# Altium schematic sheet SCH_vibration_array.schdoc
size 313 x 214 mm
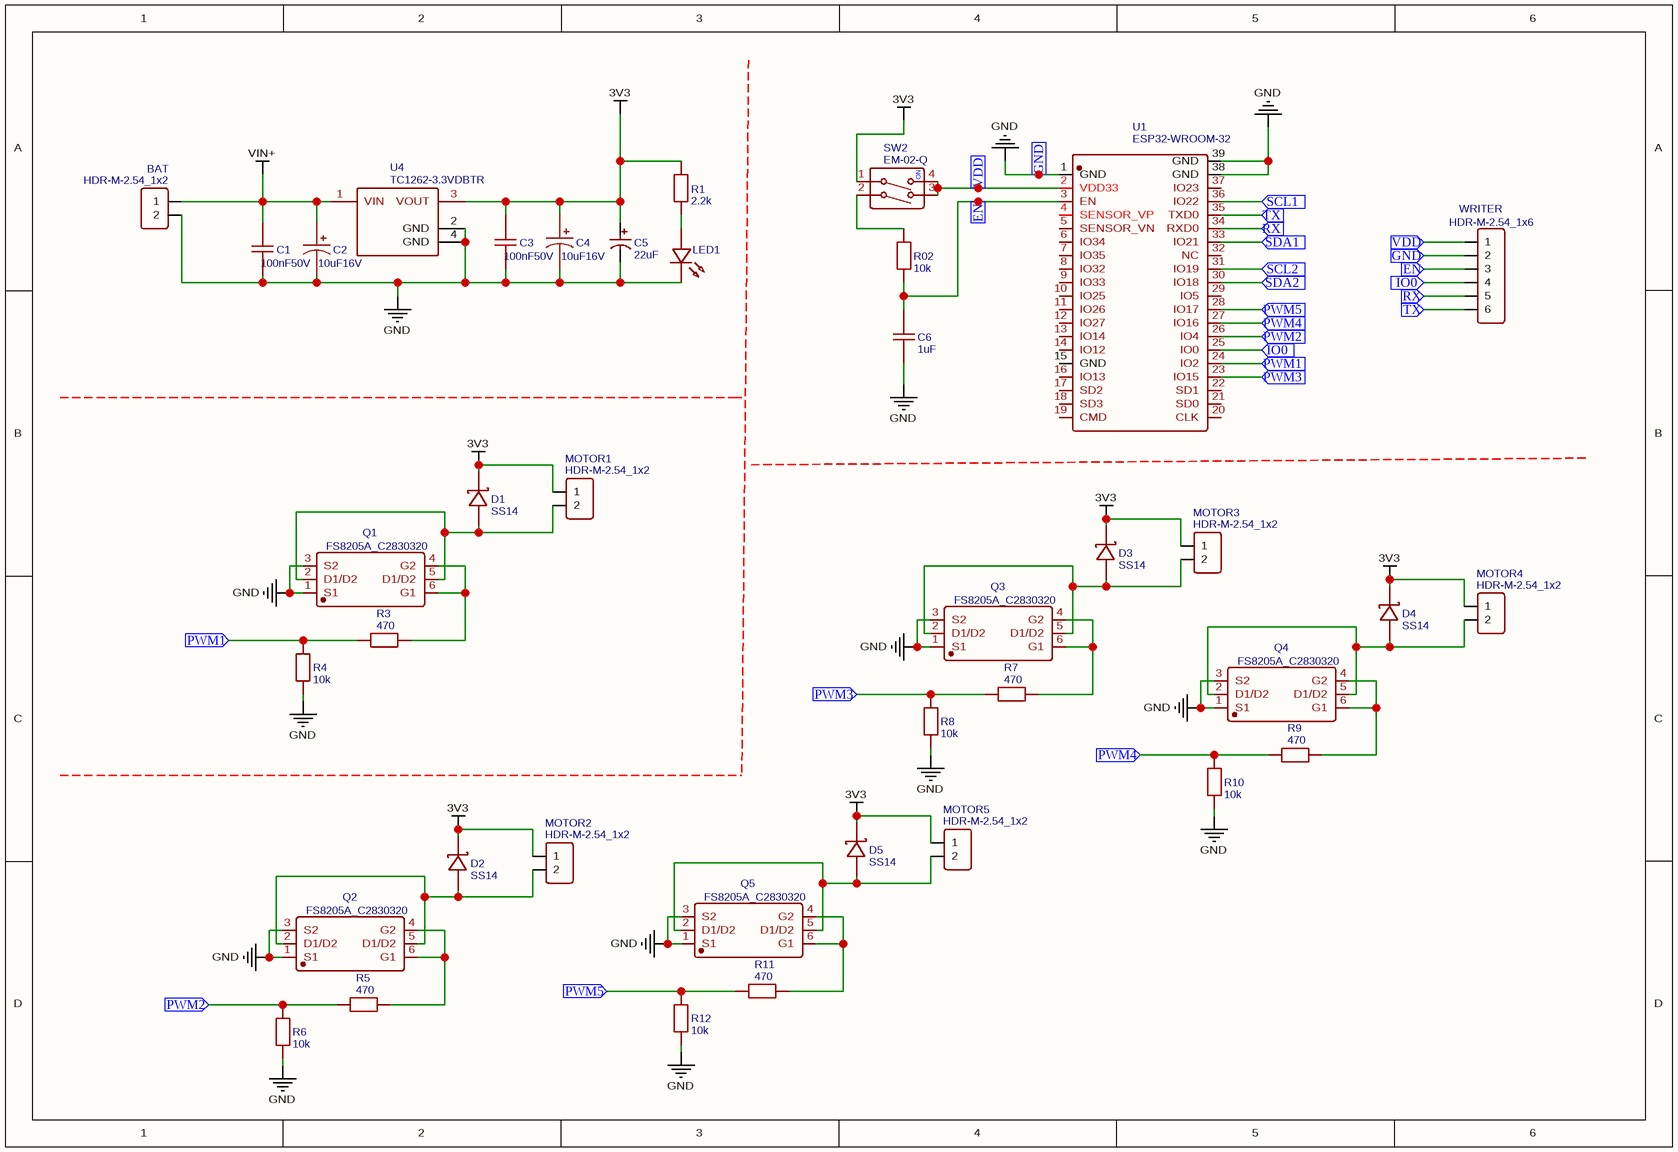
[diagram p0: SCH_vibration_array.schdoc]

## Parts
BAT  HDR-M-2.54_1x2  [HDR-M-2.54_1X2]
C1  100nF50V  [C0603]
C2  10uF16V  [C0805]
C3  100nF50V  [C0603]
C4  10uF16V  [C0805]
C5  22uF  [CAP-TH_BD5.0-P2.00-D0.8-FD]
C6  1uF  [C0603]
D1  SS14  [SMA_L4.4-W2.8-LS5.4-RD]
D2  SS14  [SMA_L4.4-W2.8-LS5.4-RD]
D3  SS14  [SMA_L4.4-W2.8-LS5.4-RD]
D4  SS14  [SMA_L4.4-W2.8-LS5.4-RD]
D5  SS14  [SMA_L4.4-W2.8-LS5.4-RD]
LED1  LED-0603_R  [LED0603_RED]  (value not drawn)
MOTOR1  HDR-M-2.54_1x2  [HDR-M-2.54_1X2]
MOTOR2  HDR-M-2.54_1x2  [HDR-M-2.54_1X2]
MOTOR3  HDR-M-2.54_1x2  [HDR-M-2.54_1X2]
MOTOR4  HDR-M-2.54_1x2  [HDR-M-2.54_1X2]
MOTOR5  HDR-M-2.54_1x2  [HDR-M-2.54_1X2]
Q1  FS8205A_C2830320  [SOT-23-6_L2.9-W1.6-P0.95-LS2.8-BR]
Q2  FS8205A_C2830320  [SOT-23-6_L2.9-W1.6-P0.95-LS2.8-BR]
Q3  FS8205A_C2830320  [SOT-23-6_L2.9-W1.6-P0.95-LS2.8-BR]
Q4  FS8205A_C2830320  [SOT-23-6_L2.9-W1.6-P0.95-LS2.8-BR]
Q5  FS8205A_C2830320  [SOT-23-6_L2.9-W1.6-P0.95-LS2.8-BR]
R1  2.2k  [R0603]
R02  10k  [R0603]
R3  470  [R0603]
R4  10k  [R0603]
R5  470  [R0603]
R6  10k  [R0603]
R7  470  [R0603]
R8  10k  [R0603]
R9  470  [R0603]
R10  10k  [R0603]
R11  470  [R0603]
R12  10k  [R0603]
SW2  EM-02-Q  [SW-SMD_4P-L5.0-W6.0-P2.54-LS9.8]
U1  ESP32-WROOM-32  [WIFIM-SMD_39P-L25.5-W18.0-P1.27]
U4  TC1262-3.3VDBTR  [SOT-223_L6.5-W3.5-P2.30-LS7.0-BR]
WRITER  HDR-M-2.54_1x6  [HDR-M-2.54_1X6]

## Ports
EN (in), GND (in), IO0 (in), PWM1 (in), PWM2 (in), PWM3 (in), PWM4 (in), PWM5 (in), RX (in), SCL1 (in), SCL2 (in), SDA1 (in), SDA2 (in), TX (in), VDD (in)

## Nets
3V3: C3.2 C4.1 C5.1 D1.1(K) D2.1(K) D3.1(K) D4.1(K) D5.1(K) MOTOR1.1 MOTOR2.1 MOTOR3.1 MOTOR4.1 MOTOR5.1 R1.2 SW2.1 U4.3(VOUT)
GND: BAT.2 C1.1 C2.2 C3.1 C4.2 C5.2 C6.1 LED1.2 Q1.1(S1) Q1.3(S2) Q2.1(S1) Q2.3(S2) Q3.1(S1) Q3.3(S2) Q4.1(S1) Q4.3(S2) Q5.1(S1) Q5.3(S2) R4.1 R6.1 R8.1 R10.1 R12.1 U1.1(GND) U1.38(GND) U1.39(GND) U4.2(GND) U4.4(GND) WRITER.2 ; port GND
VIN+: BAT.1 C1.2 C2.1 U4.1(VIN)
EN: C6.2 R02.1 U1.3(EN) WRITER.3 ; port EN
IO0: U1.25(IO0) WRITER.4 ; port IO0
PWM1: R3.1 R4.2 U1.24(IO2) ; port PWM1
PWM2: R5.1 R6.2 U1.26(IO4) ; port PWM2
PWM3: R7.1 R8.2 U1.23(IO15) ; port PWM3
PWM4: R9.1 R10.2 U1.27(IO16) ; port PWM4
PWM5: R11.1 R12.2 U1.28(IO17) ; port PWM5
RX: U1.34(RXD0) WRITER.5 ; port RX
SCL1: U1.36(IO22) ; port SCL1
SCL2: U1.31(IO19) ; port SCL2
SDA1: U1.33(IO21) ; port SDA1
SDA2: U1.30(IO18) ; port SDA2
TX: U1.35(TXD0) WRITER.6 ; port TX
VDD: SW2.3 SW2.4 U1.2(VDD33) WRITER.1 ; port VDD
NetD1_2: D1.2(A) MOTOR1.2 Q1.2(D1/D2) Q1.5(D1/D2)
NetD2_2: D2.2(A) MOTOR2.2 Q2.2(D1/D2) Q2.5(D1/D2)
NetD3_2: D3.2(A) MOTOR3.2 Q3.2(D1/D2) Q3.5(D1/D2)
NetD4_2: D4.2(A) MOTOR4.2 Q4.2(D1/D2) Q4.5(D1/D2)
NetD5_2: D5.2(A) MOTOR5.2 Q5.2(D1/D2) Q5.5(D1/D2)
NetLED1_1: LED1.1 R1.1
NetQ1_4: Q1.4(G2) Q1.6(G1) R3.2
NetQ2_4: Q2.4(G2) Q2.6(G1) R5.2
NetQ3_4: Q3.4(G2) Q3.6(G1) R7.2
NetQ4_4: Q4.4(G2) Q4.6(G1) R9.2
NetQ5_4: Q5.4(G2) Q5.6(G1) R11.2
NetR02_2: R02.2 SW2.2

Not connected (* = marked no-connect by the designer): U1 4(SENSOR_VP) 5(SENSOR_VN) 6(IO34) 7(IO35) 8(IO32) 9(IO33) 10(IO25) 11(IO26) 12(IO27) 13(IO14) 14(IO12) 15(GND) 16(IO13) 17(SD2) 18(SD3) 19(CMD) 20(CLK) 21(SD0) 22(SD1) 29(IO5) 32(NC) 37(IO23)

## Notes on the sheet
- (in symbol EM-02-Q) ON

## Library data of the parts
BAT MOTOR1-MOTOR5 = HDR-M-2.54_1x2: Contributor: LCEDA_Lib; BOM_Supplier Part: C124375; BOM_Supplier: LCSC; spicePre: J; spiceSymbolName: HDR-M-2.54_1x2
C1 C3 = 100nF50V: nameAlias: Value(F); Contributor: LCEDA_Lib; spicePre: C; spiceSymbolName: C_0603_US
C2 C4 = 10uF16V: nameAlias: Value(F); Contributor: LCEDA_Lib; spicePre: C; spiceSymbolName: C_Tan_SMD_A_US
C5 = 22uF: BOM_Manufacturer: ValuePro; BOM_Manufacturer Part: 22uF 50V 5*11; nameAlias: Capacitance; BOM_Supplier: LCSC; BOM_Supplier Part: C43346; BOM_JLCPCB Part Class: Extended Part; spicePre: C; spiceSymbolName: 22uF 50V 5*11
C6 = 1uF: nameAlias: Value(F); Contributor: LCEDA_Lib; spicePre: C; spiceSymbolName: C_0603_US
D1-D5 = SS14: BOM_Manufacturer: MDD; BOM_Supplier: LCSC; BOM_Manufacturer Part: SS14; BOM_Supplier Part: C2480; BOM_JLCPCB Part Class: Basic Part; spicePre: D; spiceSymbolName: SS14
LED1 = LED-0603_R: BOM_Manufacturer: EVERLIGHT(台湾亿光); BOM_Manufacturer Part: 19-217/R6C-AL1M2VY/3T; Contributor: LCEDA_01; BOM_Supplier Part: C72044; BOM_Supplier: LCSC; spicePre: L; spiceSymbolName: LED-0603_R
Q1-Q5 = FS8205A_C2830320: BOM_Manufacturer: TECH PUBLIC(台舟电子); Contributor: LCSC; BOM_Supplier: LCSC; BOM_Supplier Part: C2830320; BOM_Manufacturer Part: FS8205A; BOM_JLCPCB Part Class: Extended Part; spicePre: Q; spiceSymbolName: FS8205A_C2830320
R1 = 2.2k: nameAlias: Value(Ω); Contributor: LCEDA_Lib; spicePre: R; spiceSymbolName: R_0603_EU
R02 R4 R6 R8 R10 R12 = 10k: nameAlias: Value(Ω); Contributor: LCEDA_Lib; spicePre: R; spiceSymbolName: R_0603_EU
R3 R5 R7 R9 R11 = 470: nameAlias: Value(Ω); Contributor: LCEDA_Lib; spicePre: R; spiceSymbolName: R_0603_EU
SW2 = EM-02-Q: BOM_Manufacturer: Diptronics; Contributor: LCSC; BOM_Supplier: LCSC; BOM_Supplier Part: C501539; BOM_Manufacturer Part: EM-02-Q; BOM_JLCPCB Part Class: Extended Part; spicePre: S; spiceSymbolName: EM-02-Q
U1 = ESP32-WROOM-32: BOM_Manufacturer: Espressif Systems; Contributor: LCSC; BOM_Supplier: LCSC; BOM_Supplier Part: C503587; BOM_Manufacturer Part: ESP32-WROOM-32; spicePre: U; spiceSymbolName: ESP32-WROOM-32
U4 = TC1262-3.3VDBTR: BOM_Manufacturer: MICROCHIP; Contributor: LCSC; BOM_Supplier: LCSC; BOM_Manufacturer Part: TC1262-3.3VDBTR; BOM_Supplier Part: C52507; BOM_JLCPCB Part Class: Extended Part; spicePre: U; spiceSymbolName: TC1262-3.3VDBTR
WRITER = HDR-M-2.54_1x6: Contributor: LCEDA_Lib; BOM_Supplier Part: C190819; BOM_Supplier: LCSC; spicePre: J; spiceSymbolName: HDR-M-2.54_1x6